# EAGLE design Stoplight (EAGLE 7.2.0)
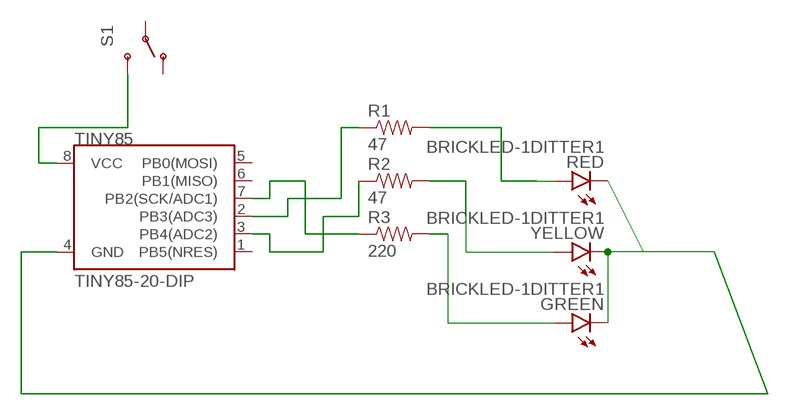
[diagram p0: schematic, sheet 1]

## Parts
GREEN  BRICKLED-1DITTER1  [BRICKLED-1DITTER]
R1  47  10KOHM-1/4W5%(PTH)  [AXIAL-0.3]
R2  47  10KOHM-1/4W5%(PTH)  [AXIAL-0.3]
R3  220  10KOHM-1/4W5%(PTH)  [AXIAL-0.3]
RED  BRICKLED-1DITTER1  [BRICKLED-1DITTER]
S1  SWITCH-SPDTKIT  [SWITCH-SPDT_KIT]
TINY85  TINY85-20-DIP  ATTINY45TINY85-20-DIP  [DIP08]
YELLOW  BRICKLED-1DITTER1  [BRICKLED-1DITTER]

## Nets
N$2: S1.3(S) TINY85.8(VCC)
N$4: R1.P$2 RED.A
N$5: GREEN.K(C) RED.K(C) TINY85.4(GND) YELLOW.K(C)
N$6: R1.P$1 TINY85.2(PB3(ADC3))
N$7: R2.P$1 TINY85.3(PB4(ADC2))
N$8: GREEN.A R3.P$2
N$9: R2.P$2 YELLOW.A
N$10: R3.P$1 TINY85.7(PB2(SCK/ADC1))
Unconnected: S1.1(O) S1.2(P) TINY85.1(PB5(NRES)) TINY85.5(PB0(MOSI)) TINY85.6(PB1(MISO))

## Library data of the parts
GREEN RED YELLOW = BrickLED:BRICKLED-1DITTER: One ditter, LEGO compatible LED
R1-R3 = SparkFun-Resistors:10KOHM-1/4W5%(PTH): RES-09435; PROD_ID: RES-9435; VALUE: 10k
S1 = SparkFun-Electromechanical:SWITCH-SPDT: SPDT Switch Simple slide switch, Spark Fun Electronics SKU : COM-00102 DPDT SMT slide switch, AYZ0202, SWCH-08179; PROD_ID: SWCH-08261
TINY85 = SparkFun-DigitalIC:ATTINY45: Atmel 8-pin 2/4/8kB flash uC; PROD_ID: IC-09445

## Board
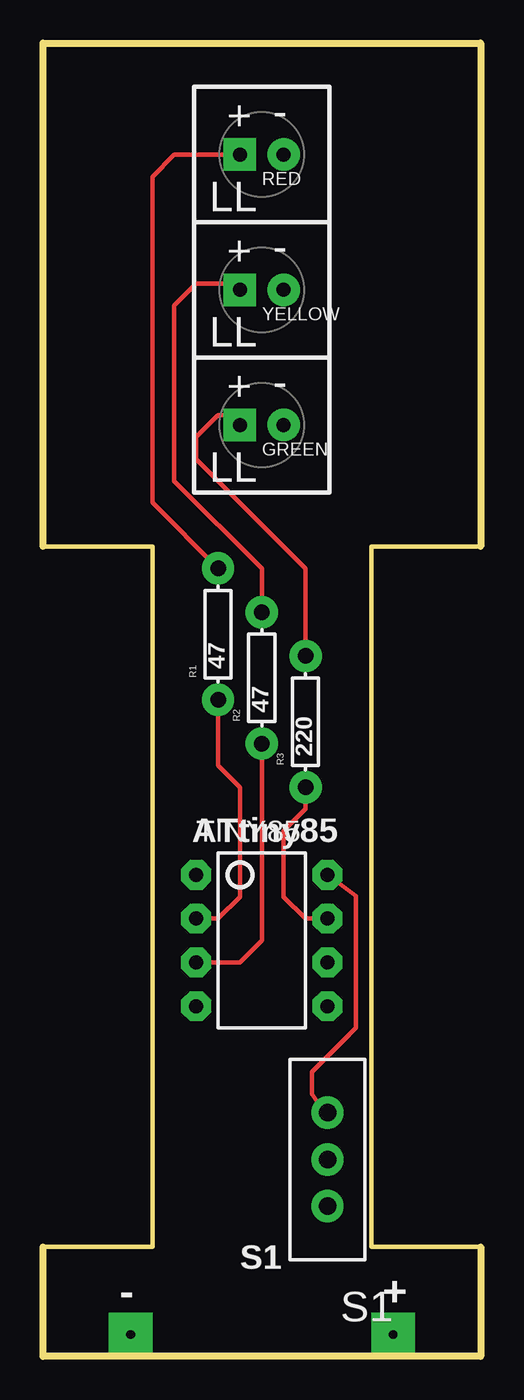
[diagram p1: board, top side]
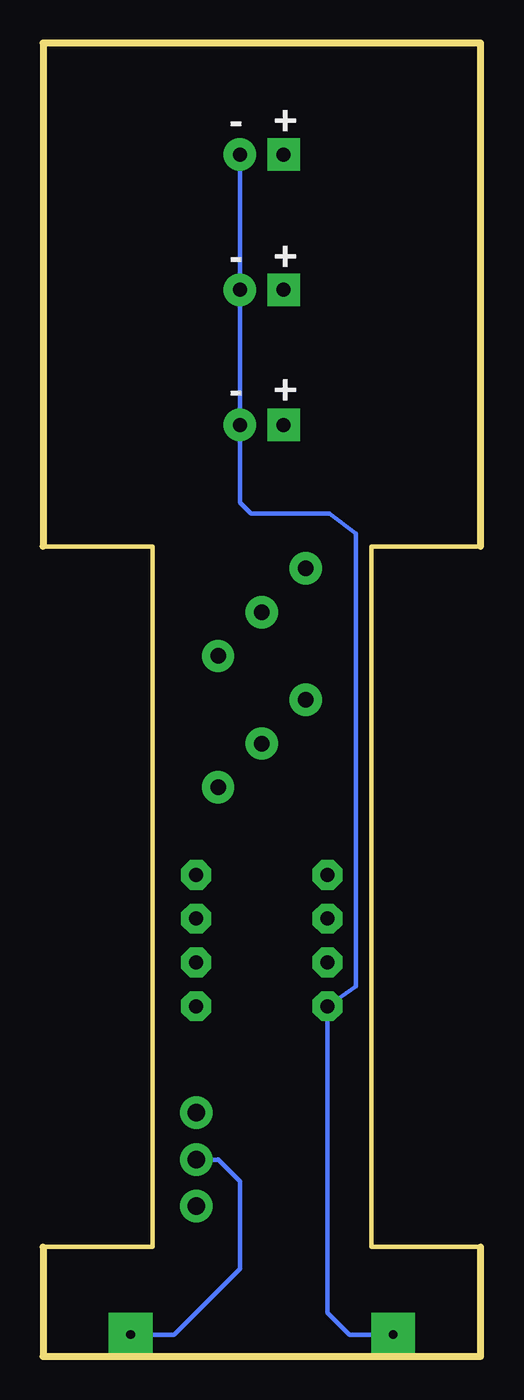
[diagram p2: board, bottom side, seen from below]

Size 25.4 x 76.2 mm. Coordinates in mm from the lower left corner, seen from the top.
Outline: 0,0 0,6.35 6.35,6.35 6.35,46.99 0,46.99 0,76.2 25.4,76.2 25.4,46.99 19.05,46.99 19.05,6.35 25.4,6.35 25.4,0 0,0
Copper layers (1*16): Top 0.035mm / dielectric 1.5mm / Bottom 0.035mm
Design rules "default": minimum track width 10mil, minimum drill 24mil, track to track 8mil, track to pad 8mil, pad to pad 8mil, via to via 8mil, smd to smd 8mil, copper to edge 40mil, drill to drill 8mil, minimum pad ring 10mil, minimum via ring 8mil, stop-mask expansion 4mil, vias tented up to drill 0mil, thermal gap 10mil

### Footprints (pad centres in the part's own frame; a part is rotated, then mirrored left to right if it is on the bottom)
BRICKLED-1DITTER = drill 0.813 pad 1.88 square: A -1.27,0 | drill 0.813 pad 1.88: K 1.27,0
AXIAL-0.3 = drill 0.9 pad 1.88: P$1 -3.81,0; P$2 3.81,0
SWITCH-SPDT_KIT = drill 1.016 pad 1.88: 1 0,2.718; 2 0,0; 3 0,-2.718
DIP08 = drill 0.813 pad 1.727 octagon: 1 -3.81,-3.81; 2 -1.27,-3.81; 3 1.27,-3.81; 4 3.81,-3.81; 5 3.81,3.81; 6 1.27,3.81; 7 -1.27,3.81; 8 -3.81,3.81

### Placement (x,y rotation side)
GREEN  12.7,54.04 0 top
R1  10.16,41.91 90 top
R2  12.7,39.37 90 top
R3  15.24,36.83 90 top
RED  12.7,69.74 0 top
S1  16.51,11.43 180 top
TINY85  12.7,24.13 270 top
YELLOW  12.7,61.89 0 top

### Tracks (layer width: path | path; a pad name or v marks a point on that pad's centre or on a via)
N$1
  Bottom 0.254: 15.31,11.42 16.03,11.42 16.04,11.43
N$2
  Top 0.254: TINY85.8 16.55,27.94 18.16,26.71 18.16,19.05 15.62,16.51 15.62,15.24 16.33,14.15 S1.3
N$3
  Bottom 0.254: 16.09,11.4 16.42,11.4
N$4
  Top 0.254: R1.P$2 6.35,49.53 6.35,68.45 7.62,69.72 RED.A
N$5
  Bottom 0.254: YELLOW.K RED.K GREEN.K 13.97,49.53 13.34,48.9 8.76,48.9 7.24,47.75 7.24,21.46 TINY85.4 8.89,2.54 7.62,1.27 5.08,1.27
N$6
  Top 0.254: R1.P$1 10.16,34.29 11.43,33.02 11.43,26.67 10.16,25.4 TINY85.2
N$7
  Top 0.254: R2.P$1 12.7,24.13 11.43,22.86 TINY85.3
N$8
  Top 0.254: R3.P$2 15.24,45.72 8.89,52.07 8.89,53.34 10.16,54.61 11.43,54.61 GREEN.A
N$9
  Top 0.254: R2.P$2 12.7,45.72 7.62,50.8 7.62,60.96 8.89,62.23 11.43,62.23 YELLOW.A
N$10
  Top 0.254: TINY85.7 15.24,25.4 13.97,26.67 13.97,30.48 15.24,31.75 R3.P$1
N$11  (via drill 0.51 pad 2.54)
  Bottom 0.254: v20.32,1.27 17.78,1.27 13.97,5.08 13.97,10.16 15.24,11.43
N$12  (via drill 0.51 pad 2.54)
  Bottom 0.254: v5.08,1.27 7.62,1.27 8.89,2.54

### Text on the board
tPlace: ATtiny85 | S1 | - | +
bPlace: + | - | + | - | + | -